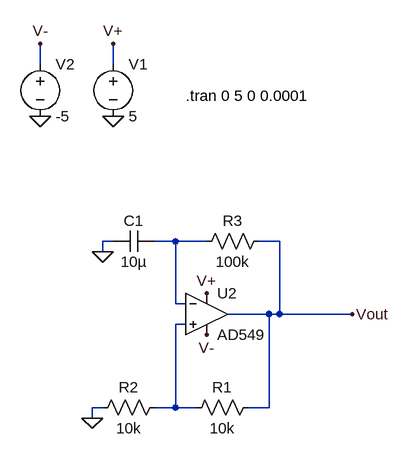
[diagram p0: schematic 06B-08.asc]
06B-08.asc, the LTspice schematic file:
Version 4.1
SHEET 1 880 680
WIRE 64 -272 64 -304
WIRE 176 -272 176 -304
WIRE 176 0 160 0
WIRE 272 0 240 0
WIRE 320 0 272 0
WIRE 432 0 400 0
WIRE 160 16 160 0
WIRE 272 96 272 0
WIRE 288 96 272 96
WIRE 416 112 352 112
WIRE 432 112 432 0
WIRE 432 112 416 112
WIRE 544 112 432 112
WIRE 288 128 272 128
WIRE 160 256 144 256
WIRE 272 256 272 128
WIRE 272 256 240 256
WIRE 304 256 272 256
WIRE 416 256 416 112
WIRE 416 256 384 256
WIRE 144 272 144 256
FLAG 144 272 0
FLAG 160 16 0
FLAG 176 -192 0
FLAG 64 -192 0
FLAG 176 -304 V+
FLAG 320 80 V+
FLAG 64 -304 V-
FLAG 320 144 V-
FLAG 544 112 Vout
SYMBOL res 400 240 R90
WINDOW 0 0 56 VBottom 2
WINDOW 3 32 56 VTop 2
SYMATTR InstName R1
SYMATTR Value 10k
SYMBOL res 256 240 R90
WINDOW 0 0 56 VBottom 2
WINDOW 3 32 56 VTop 2
SYMATTR InstName R2
SYMATTR Value 10k
SYMBOL res 416 -16 R90
WINDOW 0 0 56 VBottom 2
WINDOW 3 32 56 VTop 2
SYMATTR InstName R3
SYMATTR Value 100k
SYMBOL cap 240 -16 R90
WINDOW 0 0 32 VBottom 2
WINDOW 3 32 32 VTop 2
SYMATTR InstName C1
SYMATTR Value 10µ
SYMBOL voltage 176 -288 R0
WINDOW 123 0 0 Left 0
WINDOW 39 0 0 Left 0
SYMATTR InstName V1
SYMATTR Value 5
SYMBOL voltage 64 -288 R0
WINDOW 123 0 0 Left 0
WINDOW 39 0 0 Left 0
SYMATTR InstName V2
SYMATTR Value -5
SYMBOL OpAmps\\AD549 320 48 R0
SYMATTR InstName U2
TEXT 288 -224 Left 2 !.tran 0 5 0 0.0001

The netlist it stands for:
* 06B-08.asc
R1 Vout N002 10k
R2 N002 0 10k
R3 Vout N001 100k
C1 N001 0 10µ
V1 V+ 0 5
V2 V- 0 -5
X§U2 N002 N001 V+ V- Vout AD549  ; pins In+ In- V+ V- OUT
.tran 0 5 0 0.0001
.backanno
.end